# EAGLE schematic gps10mhz (EAGLE 9.6.2)
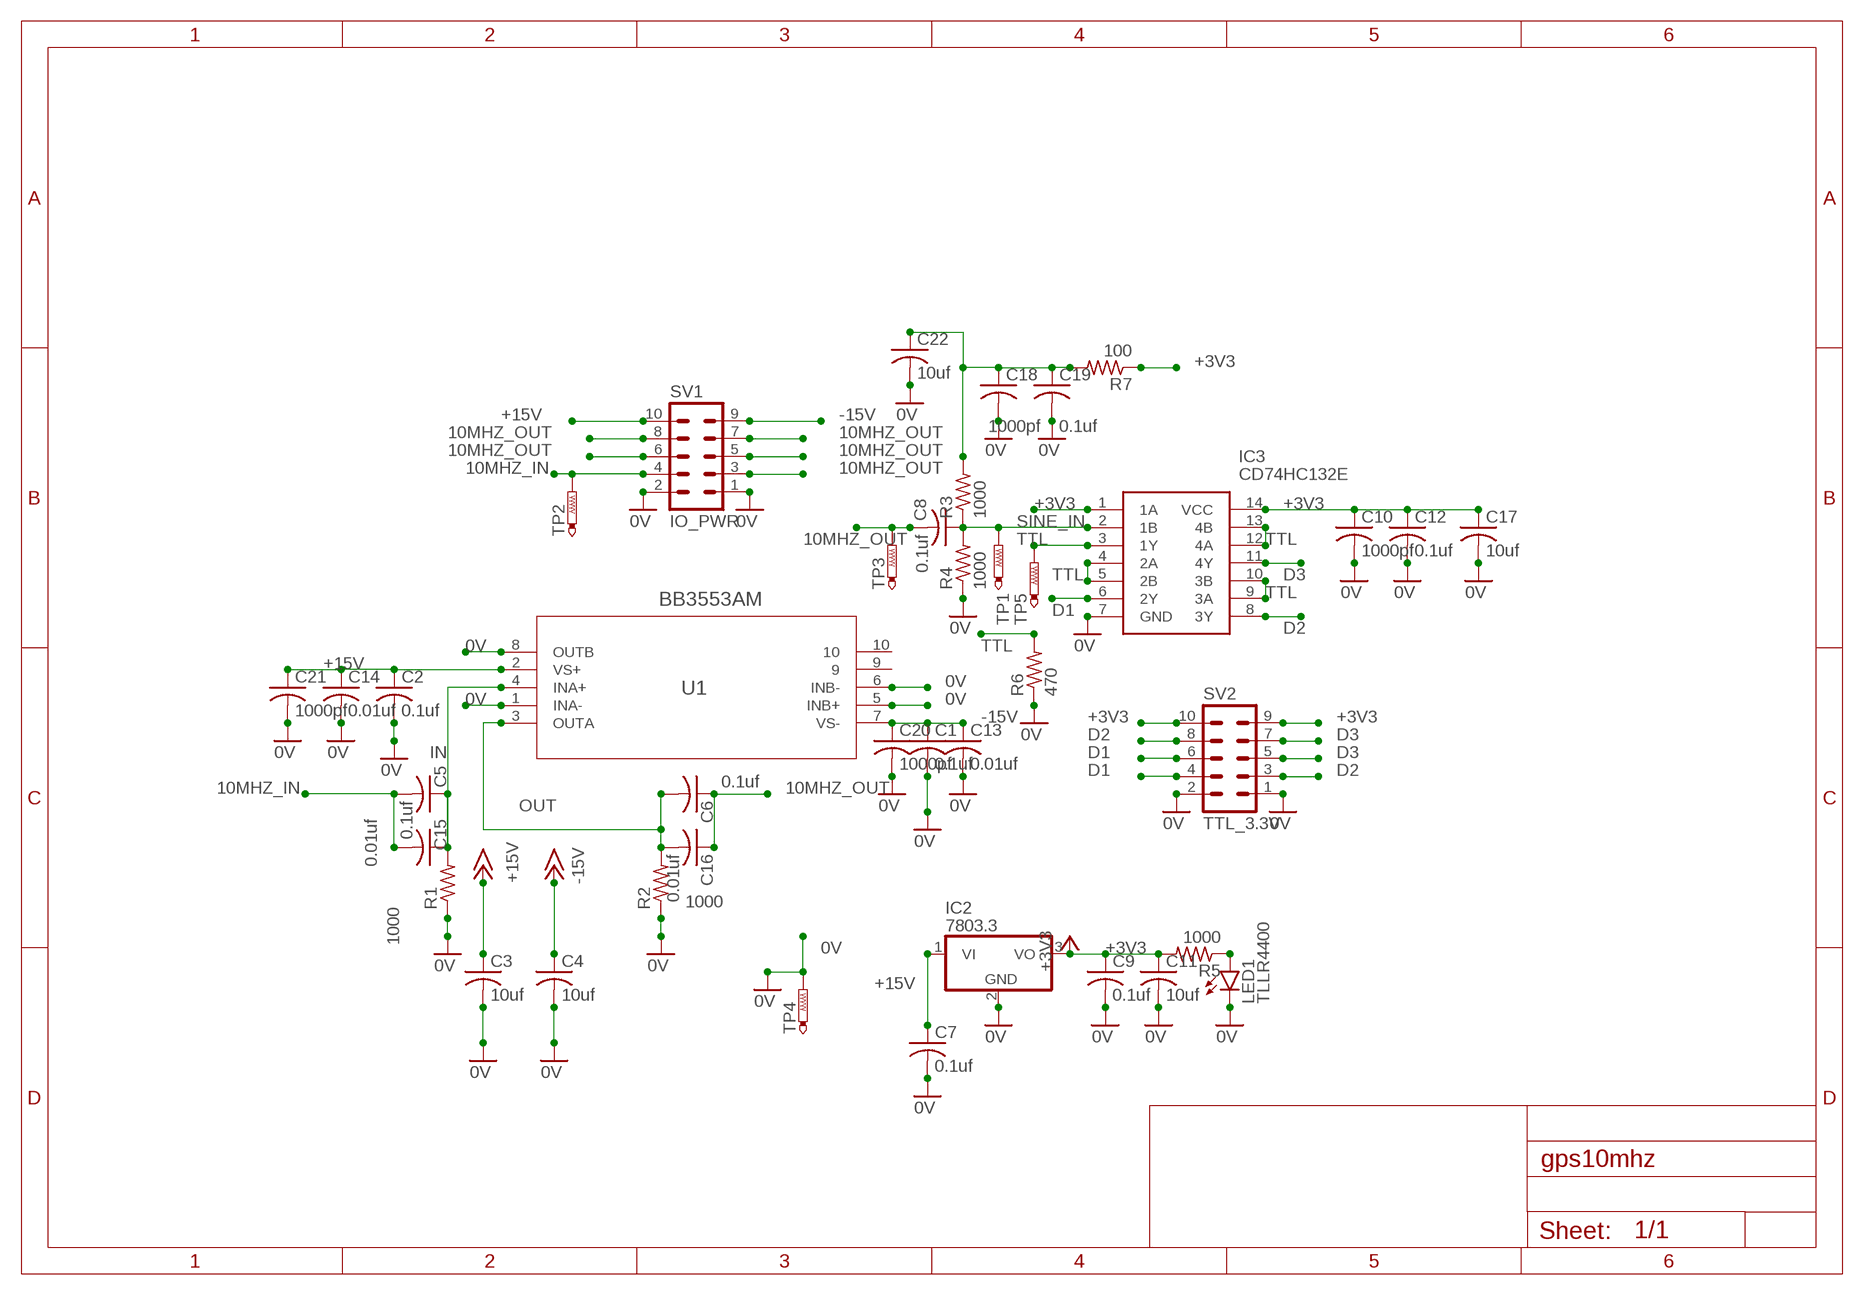
[diagram p0: schematic, sheet 1]

## Parts
C1  0.1uf  C-USC0805  [C0805]
C2  0.1uf  C-USC0805  [C0805]
C3  10uf  C-USC0805  [C0805]
C4  10uf  C-USC0805  [C0805]
C5  0.1uf  C-USC0805  [C0805]
C6  0.1uf  C-USC0805  [C0805]
C7  0.1uf  C-USC0805  [C0805]
C8  0.1uf  C-USC0805  [C0805]
C9  0.1uf  C-USC0805  [C0805]
C10  1000pf  C-USC0805  [C0805]
C11  10uf  C-USC0805  [C0805]
C12  0.1uf  C-USC0805  [C0805]
C13  0.01uf  C-USC0805  [C0805]
C14  0.01uf  C-USC0805  [C0805]
C15  0.01uf  C-USC0805  [C0805]
C16  0.01uf  C-USC0805  [C0805]
C17  10uf  C-USC0805  [C0805]
C18  1000pf  C-USC0805  [C0805]
C19  0.1uf  C-USC0805  [C0805]
C20  1000pf  C-USC0805  [C0805]
C21  1000pf  C-USC0805  [C0805]
C22  10uf  C-USC0805  [C0805]
IC2  7803.3  7805T  [TO220H]
IC3  CD74HC132E  [DIP794W53P254L1930H508Q14N]
LED1  TLLR4400  [LED3MM]
R1  1000  R-US_R1206  [R1206]
R2  1000  R-US_R1206  [R1206]
R3  1000  R-US_R1206  [R1206]
R4  1000  R-US_R1206  [R1206]
R5  1000  R-US_R1206  [R1206]
R6  470  R-US_R1206  [R1206]
R7  100  R-US_R1206  [R1206]
SV1  IO_PWR  MA05-2  [MA05-2]
SV2  TTL_3.3V  MA05-2  [MA05-2]
TP1  PTR1PAD1-13  [P1-13]
TP2  PTR1PAD1-13  [P1-13]
TP3  PTR1PAD1-13  [P1-13]
TP4  PTR1PAD1-13  [P1-13]
TP5  PTR1PAD1-13  [P1-13]
U1  BB3553AM  OPA2541AMBB3553AM  [LMF8_TEX]

## Nets
0V [wide]: C1.2 C2.2 C3.2 C4.2 C7.2 C9.2 C10.2 C11.2 C12.2 C13.2 C14.2 C17.2 C18.2 C19.2 C20.2 C21.2 C22.2 IC2.2(GND) IC3.7(GND) LED1.K(C) R1.1 R2.1 R4.1 R6.1 SV1.1 SV1.2 SV2.1 SV2.2 TP4.TP U1.1(INA-) U1.5(INB+) U1.6(INB-) U1.8(OUTB)
10MHZ_IN [icurrent]: C5.2 C15.2 SV1.4 TP2.TP
10MHZ_OUT [wide]: C6.1 C8.2 C16.1 SV1.3 SV1.5 SV1.6 SV1.7 SV1.8 TP3.TP
+3V3 [wide]: C9.1 C10.1 C11.1 C12.1 C17.1 IC2.3(VO) IC3.1(1A) IC3.14(VCC) R5.2 R7.1 SV2.9 SV2.10
+15V [wide]: C2.1 C3.1 C7.1 C14.1 C21.1 IC2.1(VI) SV1.10 U1.2(VS+)
-15V [wide]: C1.1 C4.1 C13.1 C20.1 SV1.9 U1.7(VS-)
BIASV [wide]: C18.1 C19.1 C22.1 R3.2 R7.2
D1 [icurrent]: IC3.6(2Y) SV2.4 SV2.6
D2 [icurrent]: IC3.8(3Y) SV2.3 SV2.8
D3 [icurrent]: IC3.11(4Y) SV2.5 SV2.7
IN [icurrent]: C5.1 C15.1 R1.2 U1.4(INA+)
N$1: LED1.A R5.1
OUT [wide]: C6.2 C16.2 R2.2 U1.3(OUTA)
SINE_IN [wide]: C8.1 IC3.2(1B) R3.1 R4.2 TP1.TP
TTL [icurrent]: IC3.3(1Y) IC3.4(2A) IC3.5(2B) IC3.9(3A) IC3.10(3B) IC3.12(4A) IC3.13(4B) R6.2 TP5.TP
Unconnected: U1.9 U1.10

## Library data of the parts
C1-C22 = rcl:C-US: CAPACITOR, American symbol; SPICEPREFIX: C
IC2 = linear:78*: Positive VOLTAGE REGULATOR Source: http://cache.national.com/ds/LM/LM78L05.pdf http://www.fairchildsemi.com/ds/LM/LM7805.pdf
IC3 = CD74HC132E:CD74HC132E: High Speed CMOS Logic Quad 2-Input Schmitt-Triggered NAND Gates Source: Datasheet <http://www.ti.com/lit/gpn/cd74hc132>; DESCRIPTION: High Speed CMOS Logic Quad 2-Input Schmitt-Triggered NAND Gates; HEIGHT: 5.08mm; MANUFACTURER_NAME: Texas Instruments; MANUFACTURER_PART_NUMBER: CD74HC132E; MOUSER_PART_NUMBER: 595-CD74HC132E; MOUSER_PRICE-STOCK: https://www.mouser.co.uk/ProductDetail/Texas-Instruments/CD74HC132E?qs=pt%2FIv5r0EPf0PBWbsCsSEA%3D%3D
LED1 = led:TLLR4400: Low Current (2mA) LED 3 mm Tinted Diffused Package color RED Source: Data sheet <http://www.farnell.com/datasheets/391100.pdf>; MF: VISHAY SEMICONDUCTOR; OC_FARNELL: 1612437
R1-R7 = rcl:R-US_: RESISTOR, American symbol; SPICEPREFIX: R
SV1 SV2 = con-lstb:MA05-2: PIN HEADER; OC_FARNELL: unknown; OC_NEWARK: unknown
TP1-TP5 = testpad:PTR1: TEST PIN
U1 = 2025-01-01_18-24-55_Library:OPA2541AM; COPYRIGHT: Copyright (C) 2025 Ultra Librarian. All rights reserved.; MANUFACTURER_PART_NUMBER: OPA2541AM; MFR_NAME: Texas Instruments

## Net classes
1 icurrent: width 0.305 mm
2 wide: width 0.762 mm